# EasyEDA schematic SCH_gateway.json
TITLE: Sheet_1; REV: 1.0; Date: 2024-09-18; Sheet: 1/1; Drawn By: ayrthon.pucuhuayla.c; Company: Your Company
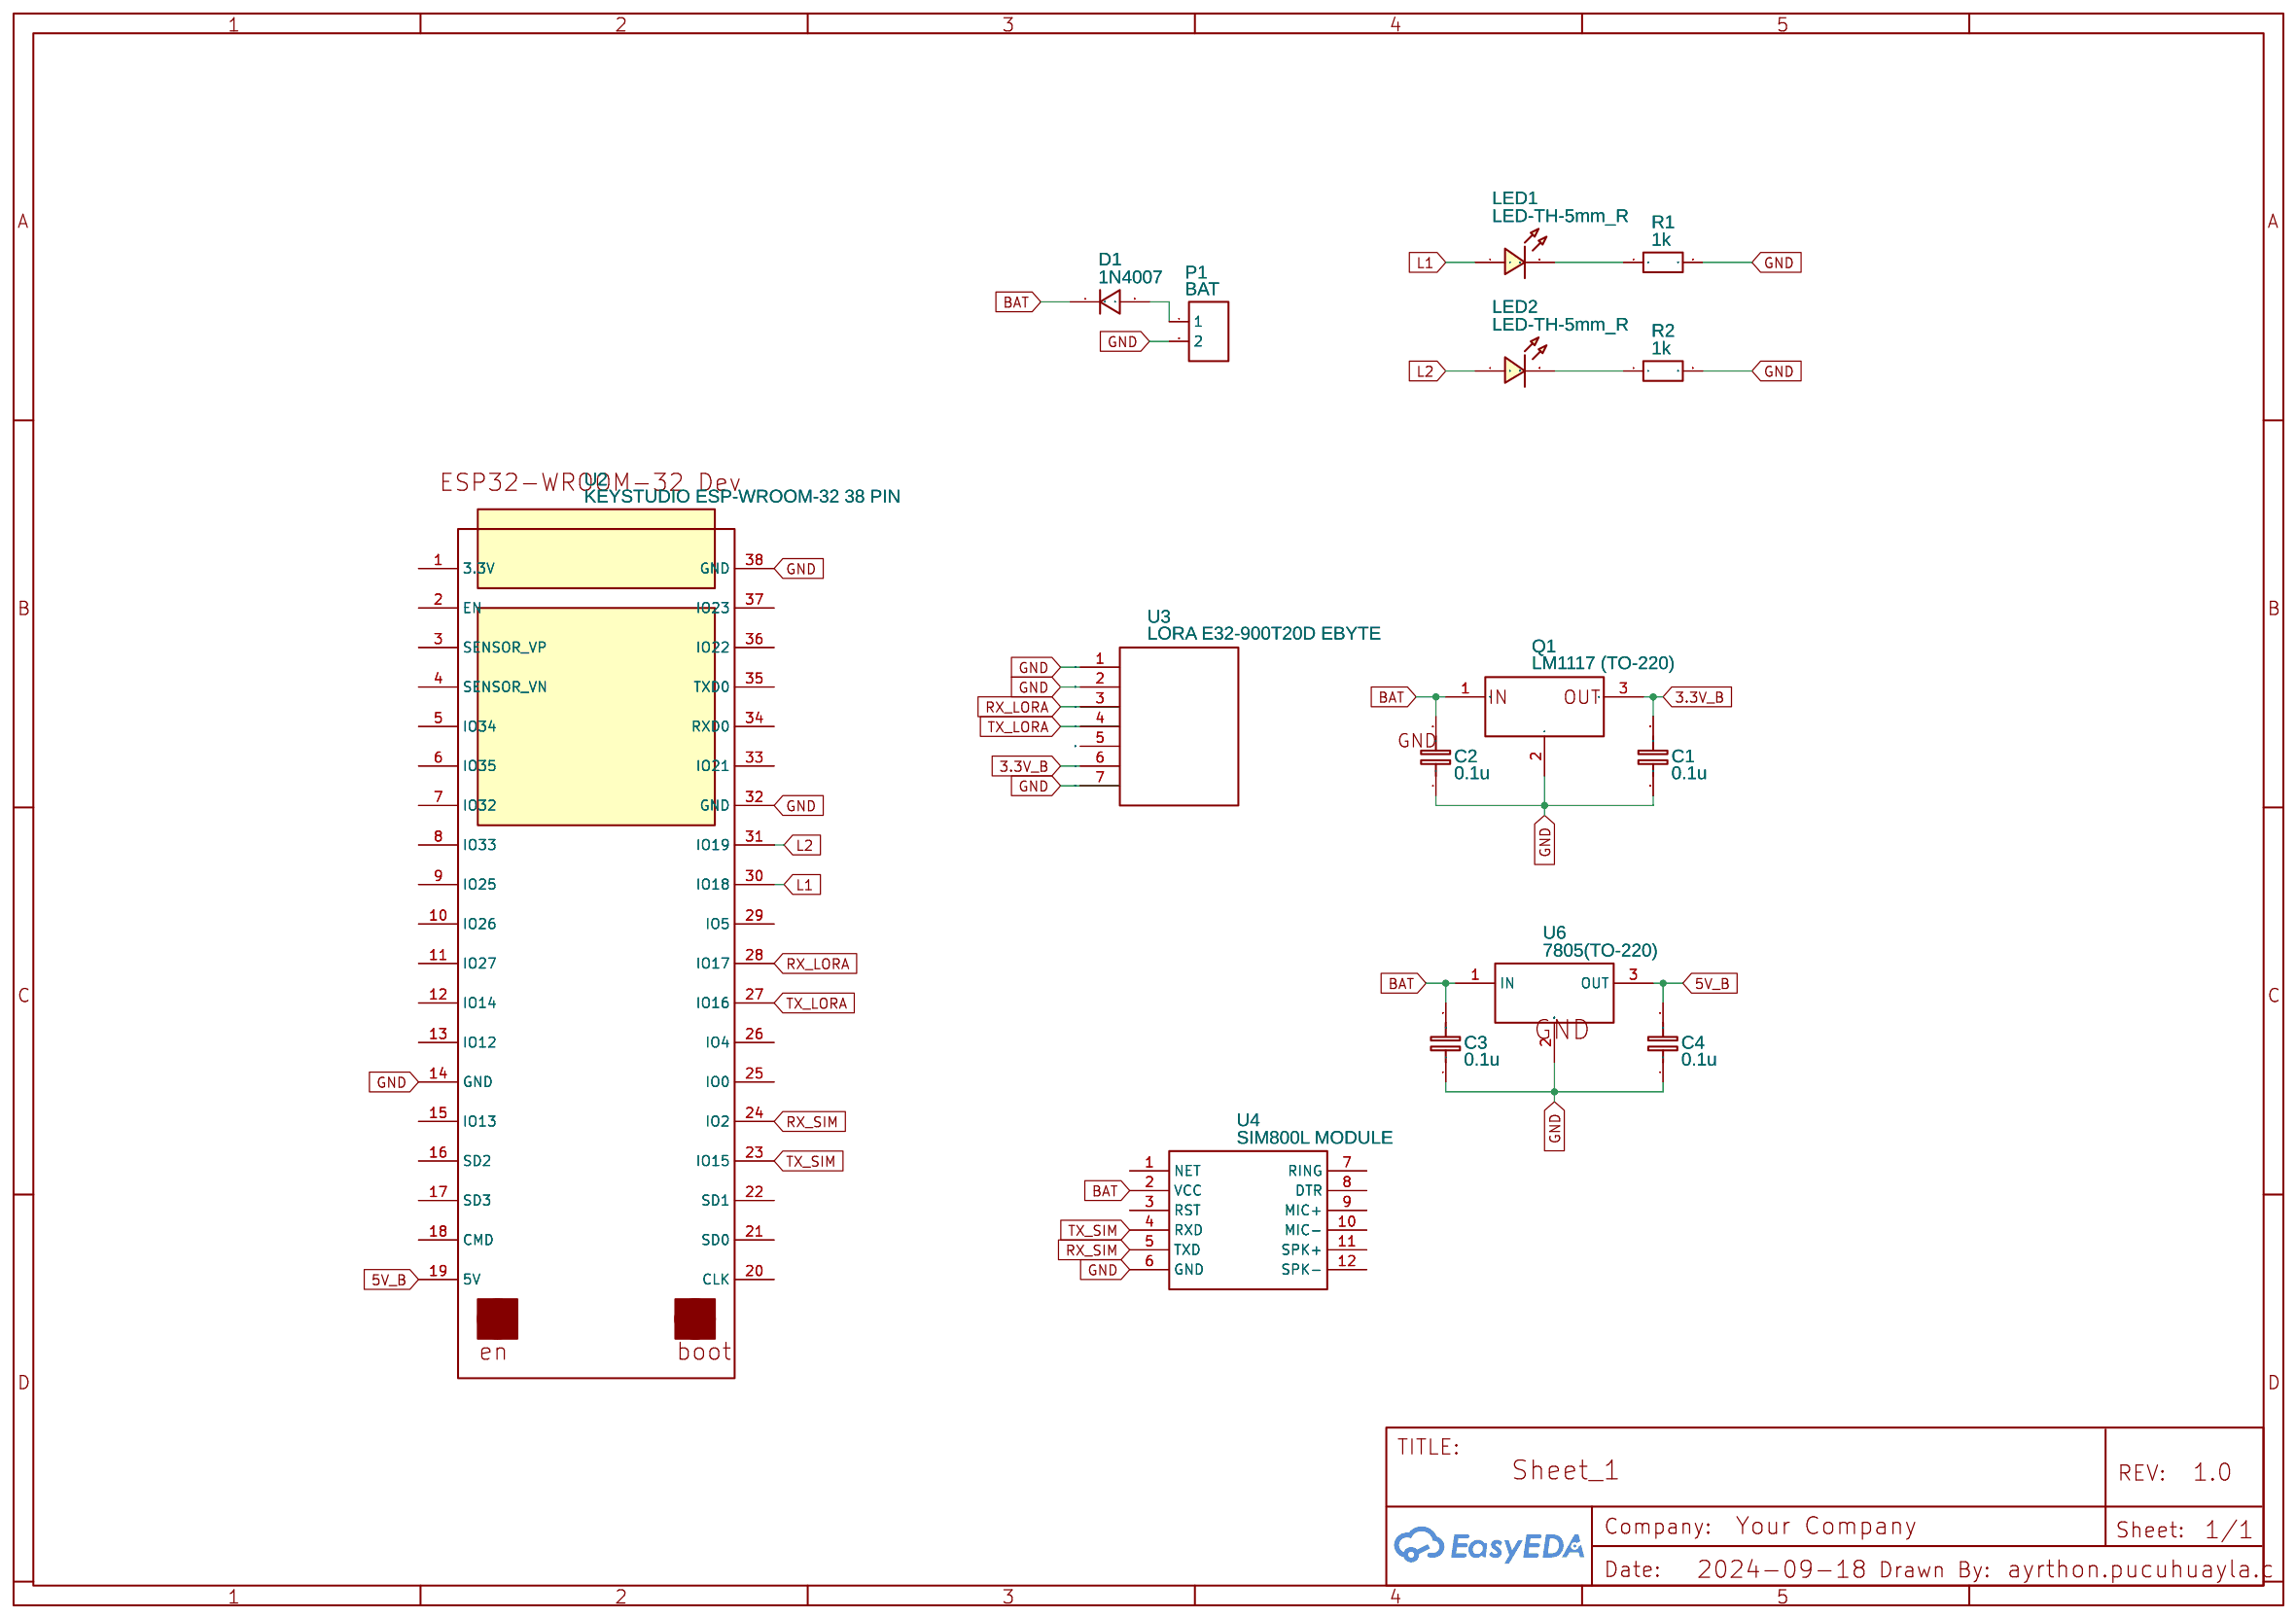
[diagram p0: schematic sheet]

## Parts
C1  0.1u  [RAD-0.1]
C2  0.1u  [RAD-0.1]
C3  0.1u  [RAD-0.1]
C4  0.1u  [RAD-0.1]
D1  1N4007  [DO-41_BD2.4-L4.7-P8.70-D0.9-RD]
LED1  LED-TH-5mm_R  [LED-TH_BD5.0_RED]
LED2  LED-TH-5mm_R  [LED-TH_BD5.0_RED]
P1  BAT  [CONN-TH_2P-P5.00]
Q1  LM1117 (TO-220)  [LM1117 (TO-220)]
R1  1k  [R_AXIAL-0.5]
R2  1k  [R_AXIAL-0.5]
U2  KEYSTUDIO ESP-WROOM-32 38 PIN  [KEYESTUDIO-ESP32-DEV]
U3  LORA E32-900T20D EBYTE  [LORA_E32-900T20D]
U4  SIM800L MODULE  [SIM800L MODULE]
U6  7805(TO-220)  [TO-220-3_L10.0-W4.5-P2.54-L]

## Library data of the parts
C1-C4 = C_RAD-0.1_EU: Contributor: LCEDA_Lib
D1 = 1N4007: Supplier: LCSC; Manufacturer: SEMTECH; Supplier Part: C106903; Contributor: LCEDA_Lib
LED1 LED2 = LED-TH-5mm_R: Manufacturer: EVERLIGHT(台湾亿光); Manufacturer Part: 333-2SURD/S530-A3; Supplier Part: C87271; Supplier: LCSC; Contributor: LCEDA_Lib
P1 = CONN-TH_2P-P5.00: Supplier: LCSC; Contributor: LCEDA_Lib
Q1 = LM1117 (TO-220): Supplier: LCSC; Contributor: microdroid2023
R1 R2 = R_AXIAL-0.5_EU: Contributor: LCEDA_Lib
U2 = KEYSTUDIO ESP-WROOM-32 38 PIN: Contributor: brianmuth
U3 = LORA E32-900T20D EBYTE: Manufacturer: EBYTE; Supplier Part: E32-868 20D; link: https://www.ebyte.com/en/product-view-news.html?id=1524; Contributor: marine.wacheux
U4 = SIM800L MODULE: Contributor: chervius
U6 = 7805(TO-220): Supplier: LCSC; Manufacturer: STMicroelectronics; Manufacturer Part: L7805CV-DG; Supplier Part: C3795; Contributor: LCEDA_Lib

## Nets
3.3V_B: C1.2 Q1.3 U3.6(VCC)
5V_B: C4.2 U2.19(5V) U6.3(OUT)
GND: C1.1 C2.1 C3.1 C4.1 P1.2 Q1.2(1) R1.2 R2.2 U2.14(GND) U2.32(GND) U2.38(GND) U3.1(M0) U3.2(M1) U3.7(GND) U4.6(GND) U6.2(GND)
BAT: C2.2 C3.2 D1.1 Q1.1(2) U4.2(VCC) U6.1(IN)
L1: LED1.1 U2.30(IO18)
L2: LED2.1 U2.31(IO19)
RX_LORA: U2.28(IO17) U3.3(RXD)
RX_SIM: U2.24(IO2) U4.5(TXD)
TX_LORA: U2.27(IO16) U3.4(TXD)
TX_SIM: U2.23(IO15) U4.4(RXD)
Net-(D1-2): D1.2 P1.1
Net-(LED1-2): LED1.2 R1.1
Net-(LED2-2): LED2.2 R2.1

Not connected (* = marked no-connect by the designer): U2 1(3.3V) 2(EN) 3(SENSOR VP) 4(SENSOR VN) 5(IO34) 6(IO35) 7(IO32) 8(IO33) 9(IO25) 10(IO26) 11(IO27) 12(IO14) 13(IO12) 15(IO13) 16(SD2) 17(SD3) 18(CMD) 20(CLK) 21(SD0) 22(SD1) 25(IO0) 26(IO4) 29(IO5) 33(IO21) 34(RXD0) 35(TXD0) 36(IO22) 37(IO23); U3 5(AUX); U4 1(NET) 3(RST) 7(RING) 8(DTR) 9(MIC+) 10(MIC-) 11(SPK+) 12(SPK-)
